# Altium project PowerAdjust.PrjPcb
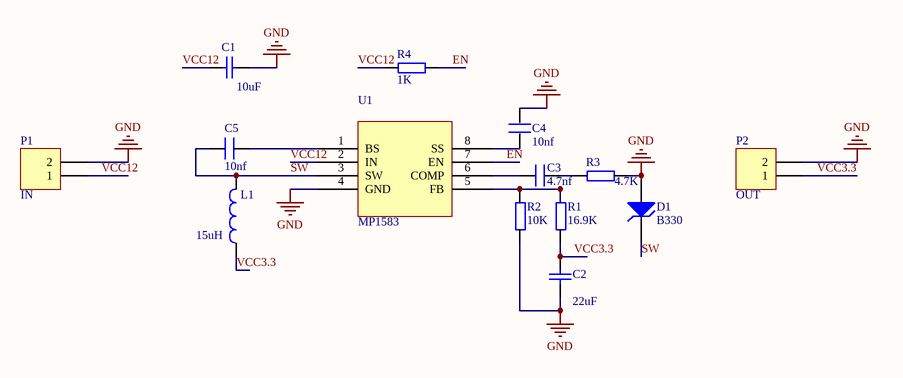
[diagram p0: ZS-007.SchDoc]
1 sheet, 14 parts. Net scope: global (net labels, ports and power ports of the same name join across sheets).
Board file: ZS-007.PcbDoc

## Sheet ZS-007.SchDoc
size Letter

### Parts
C1  value 10uF  [c0805]  (hidden comment: Cap)
C2  value 22uF  [C0805]  (hidden comment: Cap)
C3  4.7nf  [C0603]
C4  10nf  [C0603]
C5  10nf  [C0603]
D1  B330  [smb do214aa]
L1  value 15uH  [15uh]  (hidden comment: Inductor)
P1  IN  [HDR1X2]
P2  OUT  [HDR1X2]
R1  16.9K  [R0603]
R2  10K  [R0603]
R3  4.7K  [R0603]
R4  1K  [R0603]
U1  MP1583  [SOP8]

### Nets
GND: C1.2 C2.2 C4.2 D1.1(A) P1.2 P2.2 R2.1 R3.2 U1.4(GND)
EN: R4.2 U1.7(EN)
SW: C5.1 D1.2(K) L1.2 U1.3(SW)
VCC3.3: C2.1 L1.1 P2.1 R1.1
VCC12: C1.1 P1.1 R4.1 U1.2(IN)
NetC3_1: C3.1 U1.6(COMP)
NetC3_2: C3.2 R3.1
NetC4_1: C4.1 U1.8(SS)
NetC5_2: C5.2 U1.1(BS)
NetR1_2: R1.2 R2.2 U1.5(FB)

### Library data of the parts
C1 C2 = Cap0805: Capacitor; Published: 8-Jun-2000; LatestRevisionDate: 17-Jul-2002; LatestRevisionNote: Re-released for DXP Platform.; PackageReference: RAD-0.3; Publisher: Altium Limited; PackageDescription: Radial Cap, Thru-Hole; 2 Leads; 0.3 in Pin Spacing
C3-C5 = C
D1 = D Zener: Zener Diode; Published: 8-Jun-2000; LatestRevisionDate: 17-Jul-2002; LatestRevisionNote: Re-released for DXP Platform.; PackageReference: DIODE-0.7; Publisher: Altium Limited; PackageDescription: Diode, Thru-Hole; 2 Leads; 0.7 in Pin Spacing
L1 = Inductor: Code_IEC: 1005; Published: 8-Jun-2000; LatestRevisionDate: 29-May-2009; LatestRevisionNote: IPC-7351 Footprint Added.; PackageReference: 0402-A; Publisher: Altium Limited; PackageDescription: Chip Inductor; Code_JEITA: 0402
P1 P2 = Header 2: Header, 2-Pin; LatestRevisionDate: 17-Jul-2002; LatestRevisionNote: Re-released for DXP Platform.; Publisher: Altium Limited
R1-R4 = R
U1 = MP1583: DC-DC Step-Down Converter